# Altium schematic sheet Balancing.SchDoc
size 416 x 292 mm; DocumentNumber: 2; SheetNumber: 2; SheetTotal: 3
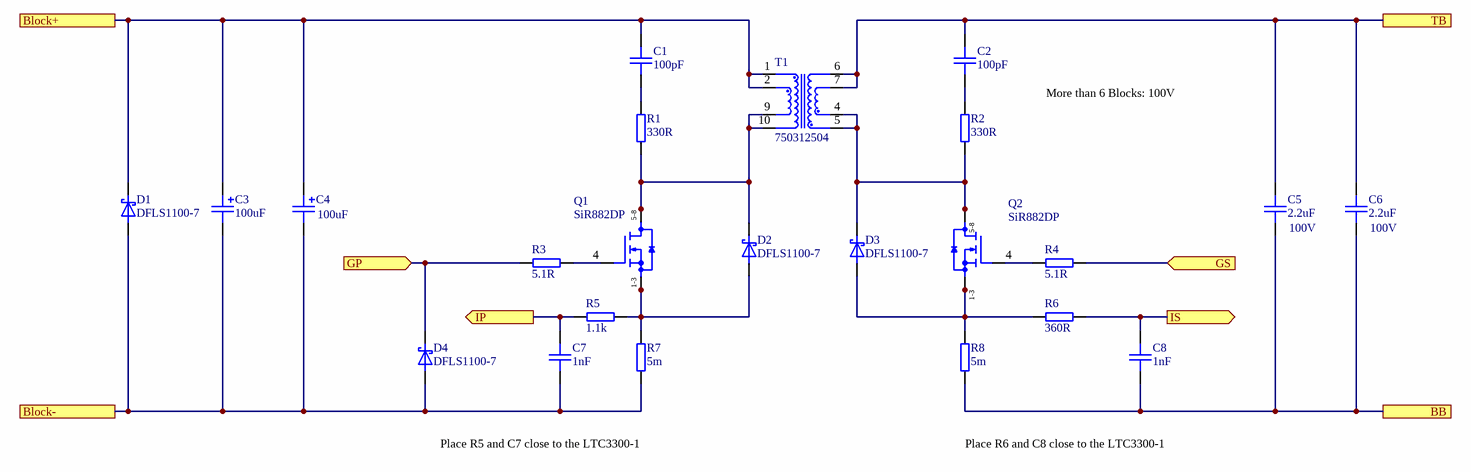
[diagram p0: Balancing.SchDoc]

## Parts
C1  100pF  [CAP 0603]
C2  100pF  [CAP 0603]
C3  100uF  [KO-CAP T591D]
C4  100uF  [KO-CAP T591D]
C5  2.2uF  Voltage: 100V  [CAP 1210]
C6  2.2uF  Voltage: 100V  [CAP 1210]
C7  1nF  [CAP 0603]
C8  1nF  [CAP 0603]
D1  DFLS1100-7  [PowerDI-123]
D2  DFLS1100-7  [PowerDI-123]
D3  DFLS1100-7  [PowerDI-123]
D4  DFLS1100-7  [PowerDI-123]
Q1  SiR882DP  [PowerPAK SO-8 Single]
Q2  SiR882DP  [PowerPAK SO-8 Single]
R1  330R  [0603]
R2  330R  [0603]
R3  5.1R  [0603]
R4  5.1R  [0603]
R5  1.1k  [0603]
R6  360R  [0603]
R7  5m  [WSL1206 2m to 5m9]
R8  5m  [WSL1206 2m to 5m9]
T1  750312504  [750312504]

## Ports
BB, Block+, Block-, GP (in), GS (in), IP (out), IS (out), TB

## Nets
BB: C5.1 C6.1 C8.1 R8.1 ; port BB
Block+: C1.2 C3.1 C4.1 D1.2 T1.1 T1.2 ; port Block+
Block-: C3.2 C4.2 C7.1 D1.1 D4.1 R7.1 ; port Block-
GP: D4.2 R3.1 ; port GP
GS: R4.2 ; port GS
IP: C7.2 R5.1 ; port IP
IS: C8.2 R6.2 ; port IS
TB: C2.2 C5.2 C6.2 T1.6 T1.7 ; port TB
NetC1_1: C1.1 R1.2
NetC2_1: C2.1 R2.2
NetD2_1: D2.1 Q1.1(S) Q1.2(S) Q1.3(S) R5.2 R7.2
NetD2_2: D2.2 Q1.5(D) Q1.6(D) Q1.7(D) Q1.8(D) R1.1 T1.9 T1.10
NetD3_1: D3.1 Q2.1(S) Q2.2(S) Q2.3(S) R6.1 R8.2
NetD3_2: D3.2 Q2.5(D) Q2.6(D) Q2.7(D) Q2.8(D) R2.1 T1.4 T1.5
NetQ1_4: Q1.4(G) R3.2
NetQ2_4: Q2.4(G) R4.1

## Notes on the sheet
- More than 6 Blocks: 100V
- Place R5 and C7 close to the LTC3300-1
- Place R6 and C8 close to the LTC3300-1
- 1
- 2
- 3
- 4
- 5
- 6
- 7
- 8
- A
- B
- C
- D
- E
- F
- Nr.
- Sheet
- of
- (in symbol 2) 5-8; 1-3

## Library data of the parts
C1 C2 = 7: ID: 7; Tolerance: 5%; Voltage: 50V; Dielectric: C0G; Value: 100pF; Mounting: SMT; Package: 0603
C3 C4 = 1: ID: 1; Tolerance: 20%; Voltage: 16V; Designation: T591D107M016ATE050; Value: 100uF; Mounting: SMT; Technology: Polymer; Package: EIA 7343-31; Supplier 1: Digi-Key; Supplier Part Number 1: 399-12271-1-ND; ComponentLink1Description: Datasheet; ComponentLink1URL: https://api.kemet.com/component-edge/download/datasheet/T591D107M016ATE050.pdf
C5 C6 = 9: ID: 9; Tolerance: 10%; Dielectric: X7R; Value: 2.2uF; Mounting: SMT; Package: 1210; Supplier 1: Digi-Key; Supplier Part Number 1: 399-13375-1-ND
C7 C8 = 6: ID: 6; Tolerance: 10%; Voltage: 50V; Dielectric: X7R; Value: 1nF; Mounting: SMT; Package: 0603
D1-D4 Q1 Q2 R7 R8 = 2: ID: 2
  D1-D4: Supplier 1: Digi-Key; Supplier Part Number 1: DFLS1100DICT-ND; ComponentLink1Description: Datasheet; ComponentLink1URL: https://www.diodes.com/assets/Datasheets/ds30497.pdf; Designation: DFLS1100-7
  Q1 Q2: Supplier 1: Digi-Key; Supplier Part Number 1: SIR882DP-T1-GE3CT-ND; ComponentLink1Description: Datasheet; ComponentLink1URL: https://www.vishay.com/docs/65932/sir882dp.pdf; Designation: SiR882DP
  R7 R8: Value: 5m; Mounting: SMT; Package: 1206
R1 R2 = 255: ID: 255; Tolerance: 1%; Power Rating: 0.1W; Value: 330R; Mounting: SMD; Type: Chip; Package: 0603
R3 R4 = 212: ID: 212; Tolerance: 1%; Power Rating: 0.1W; Value: 5.1R; Mounting: SMD; Type: Chip; Package: 0603
R5 = 268: ID: 268; Tolerance: 1%; Power Rating: 0.1W; Value: 1.1k; Mounting: SMD; Type: Chip; Package: 0603
R6 = 256: ID: 256; Tolerance: 1%; Power Rating: 0.1W; Value: 360R; Mounting: SMD; Type: Chip; Package: 0603
T1 = 2: Flyback Transformer; ID: 2; Turns Ratio: 1:1; Insulation: 0.5kV; Primary Inductance: 3.46uH; Tolerance: 10%; DCR Primary: 10m; Saturation Current: 10.2A; Device Height: 12.7mm; Mounting: SMT; DCR Secondary: 10m; Supplier 1: Digi-Key; Supplier Part Number 1: 1297-1018-1-ND; ComponentLink1Description: Datasheet; ComponentLink1URL: http://katalog.we-online.de/pbs/datasheet/750312504.pdf; Designation: 750312504